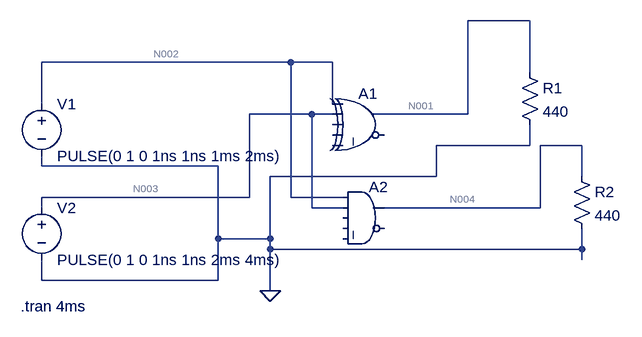
[diagram p0: schematic EEE_6.asc]
EEE_6.asc, the LTspice schematic file:
Version 4
SHEET 1 880 680
WIRE 704 -16 608 -16
WIRE 336 48 -48 48
WIRE 400 48 336 48
WIRE 704 64 704 -16
WIRE -48 112 -48 48
WIRE 400 112 400 48
WIRE 368 128 272 128
WIRE 400 128 368 128
WIRE 608 128 608 -16
WIRE 608 128 464 128
WIRE 704 176 704 144
WIRE 704 176 560 176
WIRE 784 176 720 176
WIRE -48 208 -48 192
WIRE 224 208 -48 208
WIRE 560 224 560 176
WIRE 560 224 304 224
WIRE 784 224 784 176
WIRE 272 256 272 128
WIRE 272 256 -48 256
WIRE 336 256 336 48
WIRE 416 256 336 256
WIRE -48 272 -48 256
WIRE 368 272 368 128
WIRE 416 272 368 272
WIRE 720 272 720 176
WIRE 720 272 480 272
WIRE 224 320 224 208
WIRE 304 320 304 224
WIRE 304 320 224 320
WIRE 304 336 304 320
WIRE 784 336 784 304
WIRE 784 336 304 336
WIRE 784 352 784 336
WIRE -48 384 -48 352
WIRE 224 384 224 320
WIRE 224 384 -48 384
WIRE 304 400 304 336
FLAG 304 400 0
SYMBOL voltage -48 96 R0
WINDOW 123 0 0 Left 0
WINDOW 39 0 0 Left 0
SYMATTR InstName V1
SYMATTR Value PULSE(0 1 0 1ns 1ns 1ms 2ms)
SYMBOL voltage -48 256 R0
WINDOW 123 0 0 Left 0
WINDOW 39 0 0 Left 0
SYMATTR InstName V2
SYMATTR Value PULSE(0 1 0 1ns 1ns 2ms 4ms)
SYMBOL res 688 48 R0
SYMATTR InstName R1
SYMATTR Value 440
SYMBOL res 768 208 R0
SYMATTR InstName R2
SYMATTR Value 440
SYMBOL Digital\\xor 448 80 R0
SYMATTR InstName A1
SYMBOL Digital\\and 448 224 R0
SYMATTR InstName A2
TEXT -80 424 Left 2 !.tran 4ms

The netlist it stands for:
* EEE_6.asc
V1 N002 0 PULSE(0 1 0 1ns 1ns 1ms 2ms)
V2 N003 0 PULSE(0 1 0 1ns 1ns 2ms 4ms)
R1 N001 0 440
R2 N004 0 440
A1 N002 N003 0 0 0 0 N001 0 XOR
A2 N002 N003 0 0 0 0 N004 0 AND
.tran 4ms
.backanno
.end

* Results of the author's LTspice run, read from the files saved beside the schematic
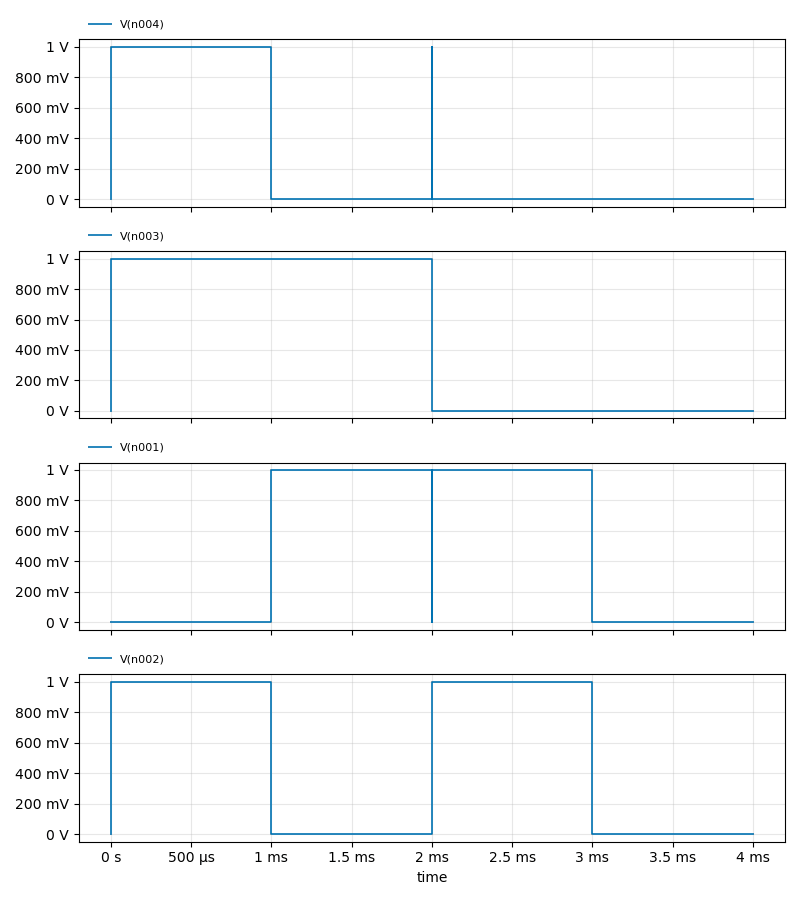
[diagram p1: Transient Analysis of EEE_6.asc, plotted from the saved traces]
* Transient Analysis, 1 run:
*   V(n004): min 0 V, max 997.7 mV, average 249.4 mV, rms 498.9 mV, last 0 V
*   V(n003): min 0 V, max 1 V, average 500 mV, rms 707.1 mV, last 0 V
*   V(n001): min 0 V, max 997.7 mV, average 498.9 mV, rms 705.5 mV, last 0 V
*   V(n002): min 0 V, max 1 V, average 500 mV, rms 707.1 mV, last 0 V